# Altium schematic sheet power_supplies.SchDoc: Pounder
size 420 x 297 mm; Author: G.Kasprowicz; CompanyName: WUT ISE; DrawnBy: G.Kasprowicz; Organization: WUT ISE; Address1: PW ISE; Address2: Nowowiejska 15/19 00-665 Warsaw; Address3: gkasprow@gmail.com; DocumentNumber: 6; Revision: 2; SheetNumber: 6; SheetTotal: 7; ModifiedBy: -; CheckedDate: -; Title2: power supply; DivGrp: WUT ISE; Designer: G.Kasprowicz; ModifiedDate: -; ProjectName: Sensor Box
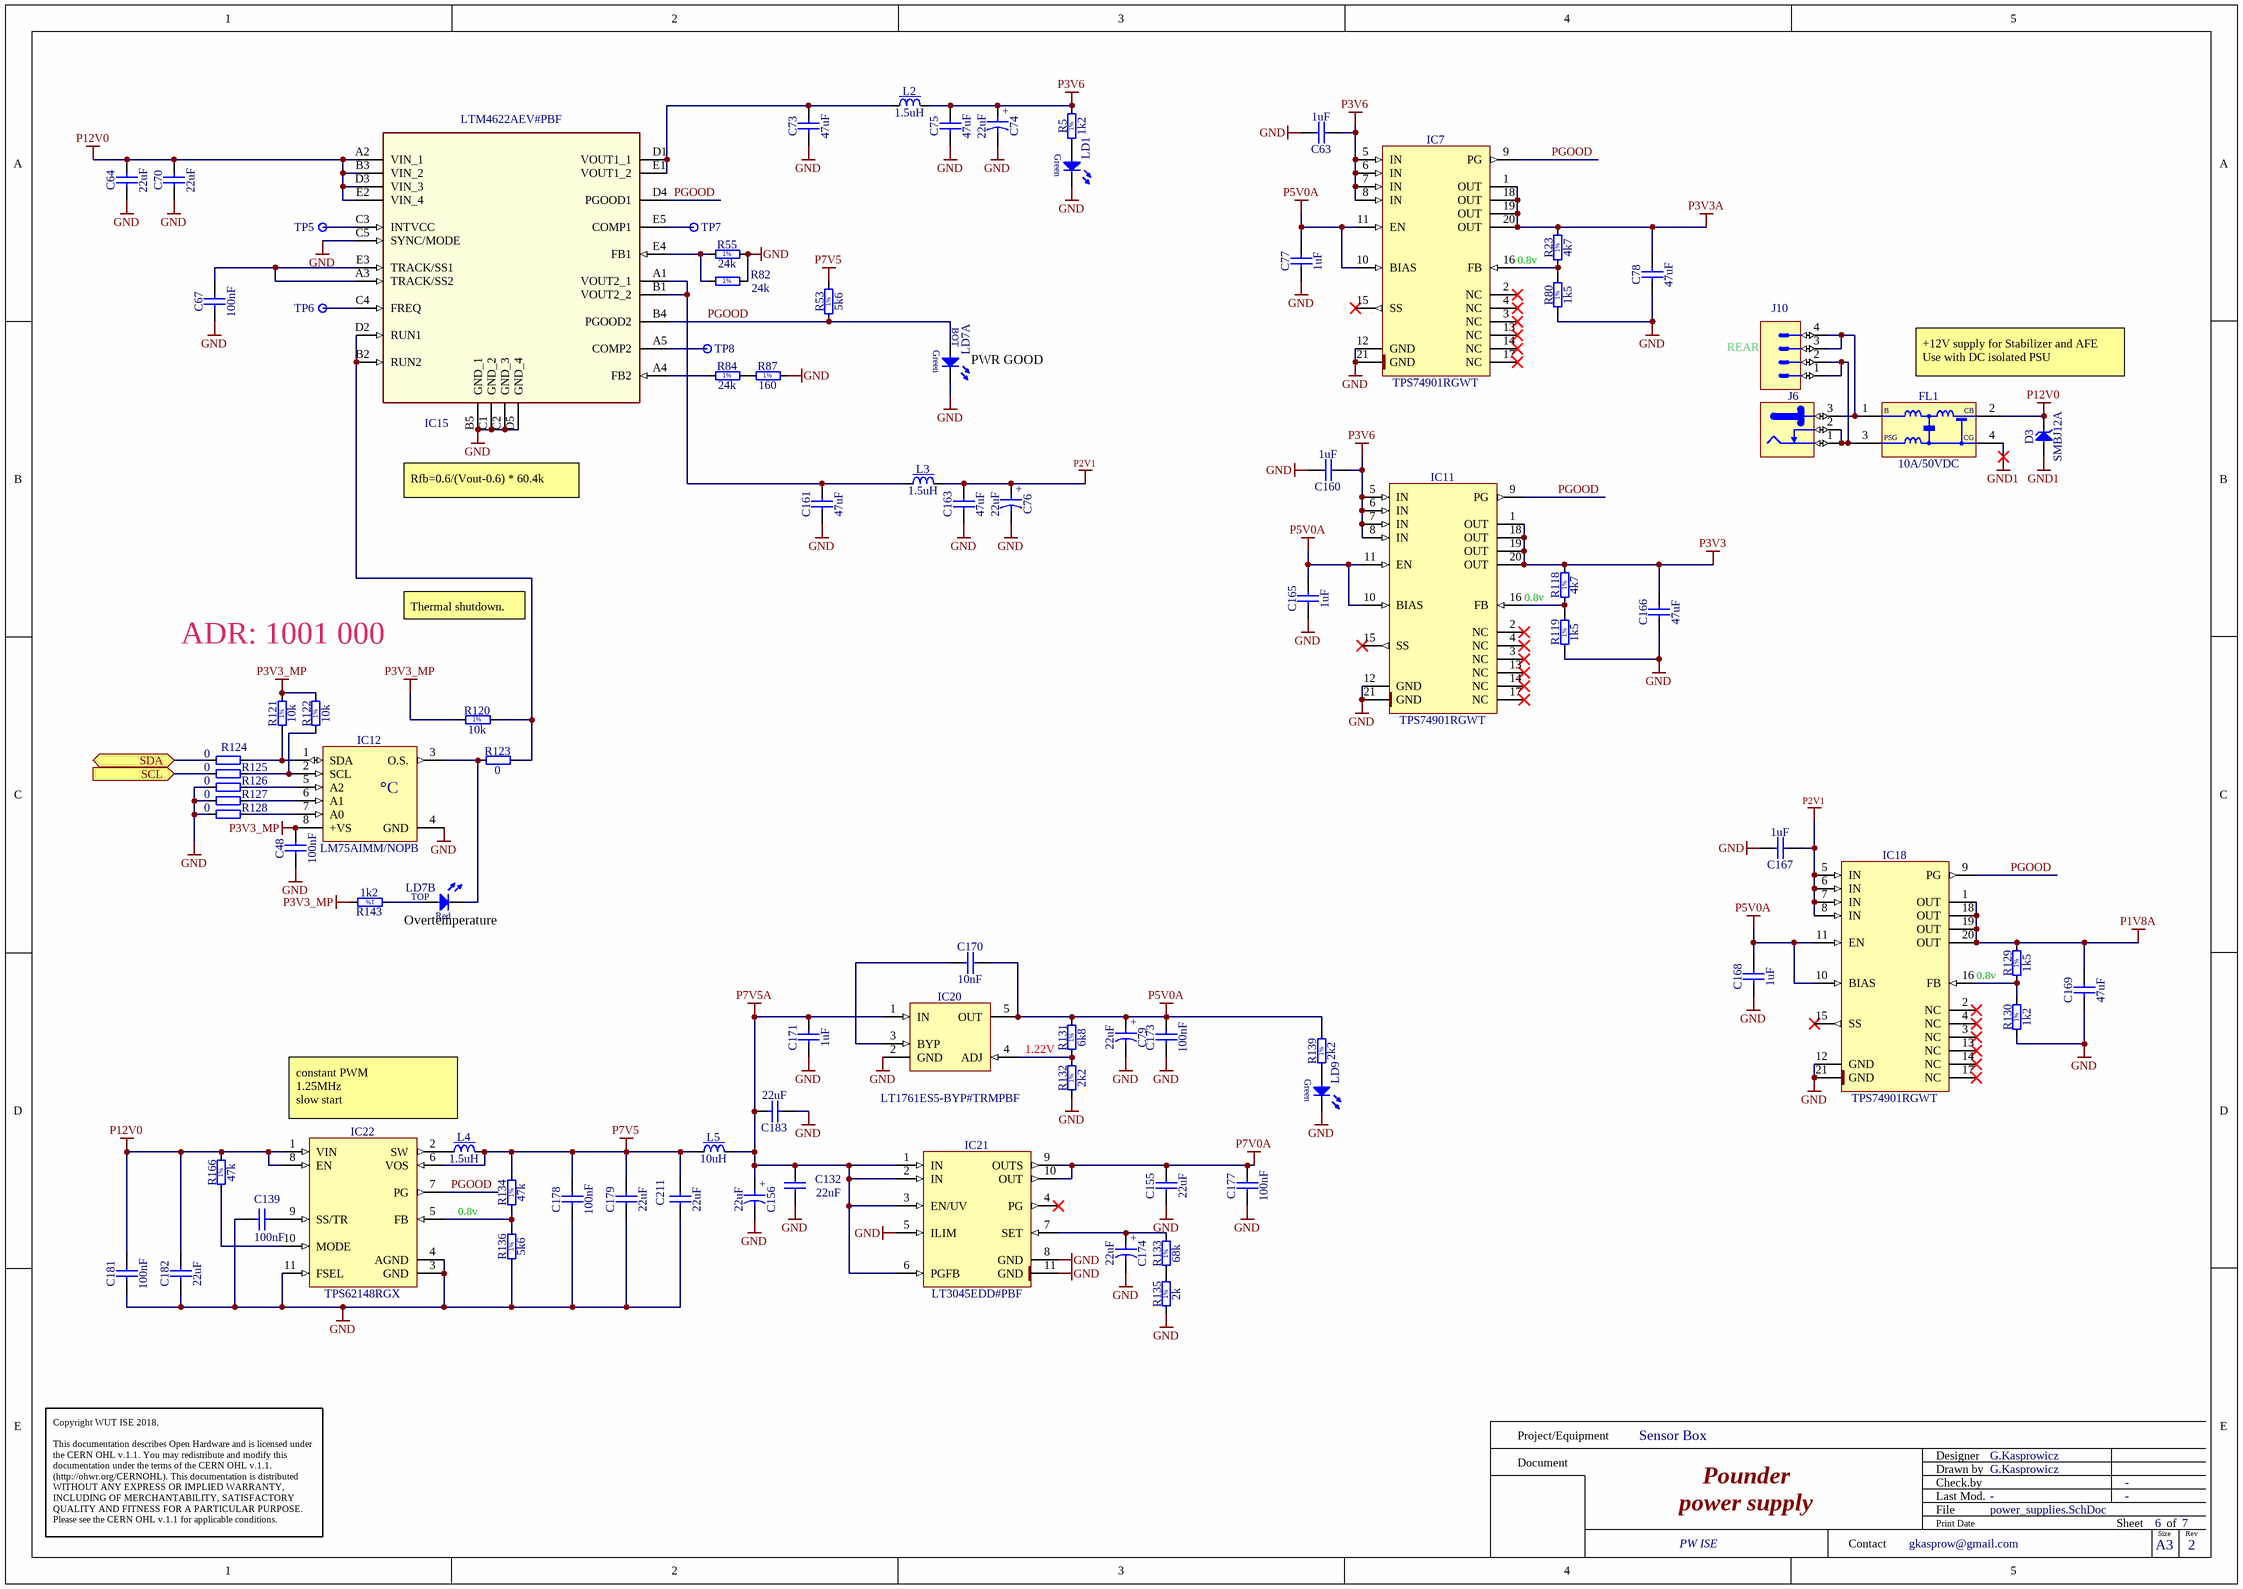
[diagram p0: power_supplies.SchDoc]

## Parts
C48  100nF  [CAPC1005X55N]
C63  1uF  [CAPC1005X55N]
C64  22uF  [CAPC2012X135N]
C67  100nF  [CAPC1005X55N]
C70  22uF  [CAPC2012X135N]
C73  47uF  [CAPC3225X270N]
C74  22uF  [CAPMP3528X210N]
C75  47uF  [CAPC3225X270N]
C76  22uF  [CAPMP3528X210N]
C77  1uF  [CAPC1005X55N]
C78  47uF  [CAPC3225X270N]
C79  22uF  [CAPMP3528X210N]
C132  22uF  [CAPC2012X135N]
C139  100nF  [CAPC1005X55N]
C155  22uF  [CAPC2012X135N]
C156  22uF  [CAPMP3528X210N]
C160  1uF  [CAPC1005X55N]
C161  47uF  [CAPC3225X270N]
C163  47uF  [CAPC3225X270N]
C165  1uF  [CAPC1005X55N]
C166  47uF  [CAPC3225X270N]
C167  1uF  [CAPC1005X55N]
C168  1uF  [CAPC1005X55N]
C169  47uF  [CAPC3225X270N]
C170  10nF  [CAPC1005X55N]
C171  1uF  [CAPC1005X55N]
C173  100nF  [CAPC1005X55N]
C174  22uF  [CAPMP3528X210N]
C177  100nF  [CAPC1005X55N]
C178  100nF  [CAPC1005X55N]
C179  22uF  [CAPC2012X135N]
C181  100nF  [CAPC1005X55N]
C182  22uF  [CAPC2012X135N]
C183  22uF  [CAPC2012X135N]
C211  22uF  [CAPC2012X135N]
D3  SMBJ12A  [DIOM5336X265N]
FL1  10A/50VDC  [FIL_MURATA_BNX02]
IC7  TPS74901RGWT  [QFN65P500X500X100-21N-S325]
IC11  TPS74901RGWT  [QFN65P500X500X100-21N-S325]
IC12  LM75AIMM/NOPB  [SOP65P490X109-8N]
IC15  LTM4622AEV#PBF  [LGA25C127P5X5_625X625X190]
IC18  TPS74901RGWT  [QFN65P500X500X100-21N-S325]
IC20  LT1761ES5-BYP#TRMPBF  [SOT95P280X100-5N]
IC21  LT3045EDD#PBF  [SON50P300X300X80-11N-R175X248]
IC22  TPS62148RGX  [TEXAS_RGX0011A]
J6  Jack  [SWITCHCRAFT_L712RA]  (value not drawn)
J10  Mini-Fit Jr.™  [MOLEX_39-30-0040]  (value not drawn)
L2  1.5uH  [IND_TDK_SPM6530]
L3  1.5uH  [IND_TDK_SPM6530]
L4  1.5uH  [IND_TDK_SPM6530]
L5  10uH  [IND_MURATA-PS_8400]
LD1  Green  [LED_KINGBRIGHT_KPH-1608CGCKr]  (value not drawn)
LD7  Red/Green  [LED_DIALIGHT_571-0112F]  (value not drawn)  (parts A,B of 2)
LD9  Green  [LED_KINGBRIGHT_KPH-1608CGCKr]  (value not drawn)
R5  1k2  [RESC1608X55N]
R23  4k7  [RESC1608X55N]
R53  5k6  [RESC1608X55N]
R55  24k  [RESC1608X55N]
R80  1k5  [RESC1608X55N]
R82  24k  [RESC1608X55N]
R84  24k  [RESC1608X55N]
R87  160  [RESC1608X55N]
R118  4k7  [RESC1608X55N]
R119  1k5  [RESC1608X55N]
R120  10k  [RESC1005X40N]
R121  10k  [RESC1005X40N]
R122  10k  [RESC1005X40N]
R123  0  [RESC1005X40N]
R124  0  [RESC1005X40N]
R125  0  [RESC1005X40N]
R126  0  [RESC1005X40N]
R127  0  [RESC1005X40N]
R128  0  [RESC1005X40N]
R129  1k5  [RESC1608X55N]
R130  1k2  [RESC1608X55N]
R131  6k8  [RESC1608X55N]
R132  2k2  [RESC1608X55N]
R133  68k  [RESC1005X40N]
R134  47k  [RESC1608X55N]
R135  2k  [RESC1005X40N]
R136  5k6  [RESC1608X55N]
R139  2k2  [RESC1608X55N]
R143  1k2  [RESC1608X55N]
R166  47k  [RESC1608X55N]
TP5  Test Point  [TPS127]  (value not drawn)
TP6  Test Point  [TPS127]  (value not drawn)
TP7  Test Point  [TPS127]  (value not drawn)
TP8  Test Point  [TPS127]  (value not drawn)

## Ports
SCL (in), SDA (bidir)

## Nets
GND: C48.1 C63.2 C64.1 C67.1 C70.1 C73.1 C74.2 C75.1 C76.2 C77.1 C78.1 C79.2 C132.1 C139.2 C155.1 C156.2 C160.2 C161.1 C163.1 C165.1 C166.1 C167.2 C168.1 C169.1 C171.1 C173.1 C174.2 C177.1 C178.1 C179.1 C181.1 C182.1 C183.1 C211.1 IC7.12(GND) IC7.21(GND) IC11.12(GND) IC11.21(GND) IC12.4(GND) IC15.B5(GND_1) IC15.C1(GND_2) IC15.C2(GND_3) IC15.C5(SYNC/MODE) IC15.D5(GND_4) IC18.12(GND) IC18.21(GND) IC20.2(GND) IC21.5(ILIM) IC21.8(GND) IC21.11(GND) IC22.3(GND) IC22.4(AGND) IC22.11(FSEL) LD1.1(C) LD7.1(C) LD9.1(C) R55.2 R80.1 R82.2 R87.2 R119.1 R126.1 R127.1 R128.1 R130.1 R132.1 R135.1 R136.1
GND1: D3.2(A) FL1.4(CG)
P1V8A: C169.2 IC18.1(OUT) IC18.18(OUT) IC18.19(OUT) IC18.20(OUT) R129.2
P2V1: C76.1 C163.2 C167.1 IC18.5(IN) IC18.6(IN) IC18.7(IN) IC18.8(IN) L3.2
P3V3: C166.2 IC11.1(OUT) IC11.18(OUT) IC11.19(OUT) IC11.20(OUT) R118.2
P3V3_MP: C48.2 IC12.8(+VS) R120.1 R121.2 R122.2 R143.2
P3V3A: C78.2 IC7.1(OUT) IC7.18(OUT) IC7.19(OUT) IC7.20(OUT) R23.2
P3V6: C63.1 C74.1 C75.2 C160.1 IC7.5(IN) IC7.6(IN) IC7.7(IN) IC7.8(IN) IC11.5(IN) IC11.6(IN) IC11.7(IN) IC11.8(IN) L2.2 R5.2
P5V0A: C77.2 C79.1 C165.2 C168.2 C170.2 C173.2 IC7.10(BIAS) IC7.11(EN) IC11.10(BIAS) IC11.11(EN) IC18.10(BIAS) IC18.11(EN) IC20.5(OUT) R131.2 R139.2
P7V0A: C155.2 C177.2 IC21.9(OUTS) IC21.10(OUT)
P7V5: C178.2 C179.2 C211.2 IC22.6(VOS) L4.2 L5.1 R53.2 R134.2
P7V5A: C132.2 C156.1 C171.2 C183.2 IC20.1(IN) IC21.1(IN) IC21.2(IN) IC21.3(EN/UV) IC21.6(PGFB) L5.2
P12V0: C64.2 C70.2 C181.2 C182.2 D3.1(C) FL1.2(CB) IC15.A2(VIN_1) IC15.B3(VIN_2) IC15.D3(VIN_3) IC15.E2(VIN_4) IC22.1(VIN) IC22.8(EN) R166.2
PGOOD: IC7.9(PG) IC11.9(PG) IC15.B4(PGOOD2) IC15.D4(PGOOD1) IC18.9(PG) IC22.7(PG) LD7.2(A) R53.1
SCL: R125.1 ; port SCL
SDA: R124.1 ; port SDA
NetC67_2: C67.2 IC15.A3(TRACK/SS2) IC15.E3(TRACK/SS1)
NetC73_2: C73.2 IC15.D1(VOUT1_1) IC15.E1(VOUT1_2) L2.1
NetC139_1: C139.1 IC22.9(SS/TR)
NetC161_2: C161.2 IC15.A1(VOUT2_1) IC15.B1(VOUT2_2) L3.1
NetC170_1: C170.1 IC20.3(BYP)
NetC174_1: C174.1 IC21.7(SET) R133.2
NetFL1_1: FL1.1(B) J6.3 J10.3 J10.4
NetFL1_3: FL1.3(PSG) J6.1 J6.2 J10.1 J10.2
NetIC7_16: IC7.16(FB) R23.1 R80.2
NetIC11_16: IC11.16(FB) R118.1 R119.2
NetIC12_1: IC12.1(SDA) R121.1 R124.2
NetIC12_2: IC12.2(SCL) R122.1 R125.2
NetIC12_3: IC12.3(O.S.) LD7.3(C) R123.1
NetIC12_5: IC12.5(A2) R126.2
NetIC12_6: IC12.6(A1) R127.2
NetIC12_7: IC12.7(A0) R128.2
NetIC15_A4: IC15.A4(FB2) R84.1
NetIC15_A5: IC15.A5(COMP2) TP8.1
NetIC15_B2: IC15.B2(RUN2) IC15.D2(RUN1) R120.2 R123.2
NetIC15_C3: IC15.C3(INTVCC) TP5.1
NetIC15_C4: IC15.C4(FREQ) TP6.1
NetIC15_E4: IC15.E4(FB1) R55.1 R82.1
NetIC15_E5: IC15.E5(COMP1) TP7.1
NetIC18_16: IC18.16(FB) R129.1 R130.2
NetIC20_4: IC20.4(ADJ) R131.1 R132.2
NetIC22_2: IC22.2(SW) L4.1
NetIC22_5: IC22.5(FB) R134.1 R136.2
NetIC22_10: IC22.10(MODE) R166.1
NetLD1_2: LD1.2(A) R5.1
NetLD7_4: LD7.4(A) R143.1
NetLD9_2: LD9.2(A) R139.1
NetR84_2: R84.2 R87.1
NetR133_1: R133.1 R135.2

Not connected (* = marked no-connect by the designer): IC7 2(NC)* 3(NC)* 4(NC)* 13(NC)* 14(NC)* 15(SS)* 17(NC)*; IC11 2(NC)* 3(NC)* 4(NC)* 13(NC)* 14(NC)* 15(SS)* 17(NC)*; IC18 2(NC)* 3(NC)* 4(NC)* 13(NC)* 14(NC)* 15(SS)* 17(NC)*; IC21 4(PG)*

## Notes on the sheet
- 0.8v
- (near LD7) PWR GOOD
- (near J10) REAR
- +12V supply for Stabilizer and AFE
  Use with DC isolated PSU
- Rfb=0.6/(Vout-0.6) * 60.4k
- ADR: 1001 000
- Thermal shutdown.
- (near LD7) Overtemperature
- 1.22V
- constant PWM
  1.25MHz
  slow start
- Project/Equipment
- Document
- Designer
- Drawn by
- Check.by
- Copyright WUT ISE 2018.
  This documentation describes Open Hardware and is licensed under the CERN OHL v.1.1. You may redistribute and modify this documentation under the terms of the CERN OHL v.1.1. (http://ohwr.org/CERNOHL). This documentation is distributed WITHOUT ANY EXPRESS OR IMPLIED WARRANTY, INCLUDING OF MERCHANTABILITY, SATISFACTORY QUALITY AND FITNESS FOR A PARTICULAR PURPOSE. Please see the CERN OHL v.1.1 for applicable conditions.
- Contact
- File
- Last Mod.
- Print Date
- Sheet
- Size
- A3
- of
- Rev
- (in symbol CTE3528-21_22UF_10V_10%_LESR0700) +
- (in symbol LED_DIALIGHT_571-0112F, part A) BOT; Green
- (in symbol LED_DIALIGHT_571-0112F, part B) TOP; Red
- (in symbol LM75AIMM/NOPB) °C
- (in symbol R0402_2K_1%_0.0625W_100PPM) 1%
- (in symbol R0402_10K_1%_0.0625W_100PPM) 1%
- (in symbol R0402_68K_1%_0.0625W_100PPM) 1%
- (in symbol R0603_1K2_1%_0.1W_100PPM) 1%
- (in symbol R0603_1K5_1%_0.1W_100PPM) 1%
- (in symbol R0603_2K2_1%_0.1W_100PPM) 1%
- (in symbol R0603_4K7_1%_0.1W_100PPM) 1%
- (in symbol R0603_5k6_1%_0.1W_100PPM) 1%
- (in symbol R0603_5K6_1%_0.1W_100PPM) 1%
- (in symbol R0603_6K8_1%_0.1W_100PPM) 1%
- (in symbol R0603_24K_1%_0.1W_100PPM) 1%
- (in symbol R0603_47K_1%_0.1W_100PPM) 1%
- (in symbol R0603_160R_1%_0.1W_100PPM) 1%

## Library data of the parts
C48 C67 C139 C173 C177 C178 C181 = CC0402_100NF_16V_10%_X5R: Non-polarised capacitor; Part Description: SMD Multilayer Chip Ceramic Capacitor; Manufacturer: GENERIC; Manufacturer1 Part Number: GRM155R61C104KA88D; Voltage: 16V; TC: X5R; Tolerance: ±10%; Part Number: CC0402_100NF_16V_10%_X5R; Component Kind: Standard; Component Type: Standard; Pin Count: 2; Value: 100nF; Status: None; Manufacturer Part Number: CC0402_100NF_16V_10%_X5R; Case: 0402; Mounted: Yes; Socket: No; SMD: Yes; Sense: No; Manufacturer1 Example: MURATA; Manufacturer1 ComponentHeight: 0.55mm; HelpURL: \\cern.ch\dfs\Applications\Altium\Datasheets\CC0402_X5R_MURATA_GRM.pdf; Author: CERN DEM JLC; CreateDate: 10.12.2013; LatestRevisionDate: 10.12.2013
C63 C77 C160 C165 C167 C168 C171 = CC0402_1UF_16V_10%_X5R: Non-polarised capacitor; Part Description: SMD Multilayer Chip Ceramic Capacitor; Manufacturer: GENERIC; Manufacturer1 Part Number: C1005X5R1C105KT; Voltage: 16V; TC: X5R; Tolerance: ±10%; Part Number: CC0402_1UF_16V_10%_X5R; Component Kind: Standard; Component Type: Standard; Pin Count: 2; Value: 1uF; Status: Preferred; Manufacturer Part Number: CC0402_1UF_16V_10%_X5R; Case: 0402; Mounted: Yes; Socket: No; SMD: Yes; Sense: No; Manufacturer1 Example: TDK; Manufacturer1 ComponentHeight: 0.55mm; HelpURL: \\cern.ch\dfs\Applications\Altium\Datasheets\CC0402_X5R_TDK_C.pdf; Author: CERN DEM JLC
  C63 C77 C160 C165 C167 C168: CreateDate: 2012-10-25; LatestRevisionDate: 2012-10-25
  C171: CreateDate: 25.10.2012; LatestRevisionDate: 25.10.2012
C64 C70 C132 C155 C179 C182 C183 C211 = CC0805_22UF_16V_10%_X5R: Non-polarised capacitor; Part Description: SMD Multilayer Chip Ceramic Capacitor; Manufacturer: GENERIC; Manufacturer1 Part Number: C2012X5R1C226KT; Voltage: 16V; TC: X5R; Tolerance: ±10%; Part Number: CC0805_22UF_16V_10%_X5R; Component Kind: Standard; Component Type: Standard; Pin Count: 2; Value: 22uF; Status: Preferred; Manufacturer Part Number: CC0805_22UF_16V_10%_X5R; Case: 0805; Mounted: Yes; Socket: No; SMD: Yes; Sense: No; Manufacturer1 Example: TDK; Manufacturer1 ComponentHeight: 1.35mm; HelpURL: \\cern.ch\dfs\Applications\Altium\Datasheets\CC0805_X5R_TDK_C.pdf; Author: CERN DEM JLC; CreateDate: 25.10.2012; LatestRevisionDate: 25.10.2012
C73 C75 C78 C161 C163 C166 C169 = CC1210_47UF_10V_20%_X5R: Non-polarised capacitor; Part Description: SMD Multilayer Chip Ceramic Capacitor; Manufacturer: GENERIC; Manufacturer1 Part Number: LMK325BJ476MM-T; Voltage: 10V; TC: X5R; Tolerance: ±20%; Part Number: CC1210_47UF_10V_20%_X5R; Component Kind: Standard; Component Type: Standard; Pin Count: 2; Value: 47uF; Status: None; Manufacturer Part Number: CC1210_47UF_10V_20%_X5R; Case: 1210; Mounted: Yes; Socket: No; SMD: Yes; Sense: No; Manufacturer1 Example: TAIYO YUDEN; Manufacturer1 ComponentHeight: 2.7mm; HelpURL: \\cern.ch\dfs\Applications\Altium\Datasheets\CC1210_X5R_TAIYO-YUDEN_HIGH-VALUE.pdf; Author: CERN DEM JLC; CreateDate: 04.05.2011; LatestRevisionDate: 04.05.2011
C74 C76 C79 C156 C174 = CTE3528-21_22UF_10V_10%_LESR0700: Polarised capacitor; Part Description: Low ESR 0R7 Solid Tantalum Chip Capacitor; Manufacturer: GENERIC; Manufacturer1 Part Number: TPSB226K010R0700; Voltage: 10V; Tolerance: ±10%; Part Number: CTE3528-21_22UF_10V_10%_LESR0700; Component Kind: Standard; Component Type: Standard; Pin Count: 2; Value: 22uF; Status: Preferred; Manufacturer Part Number: CTE3528-21_22UF_10V_10%_LESR0700; Case: B; Mounted: Yes; Socket: No; SMD: Yes; Sense: No; Manufacturer1 Example: AVX; Manufacturer1 ComponentHeight: 2.1mm; HelpURL: \\cern.ch\dfs\Applications\Altium\Datasheets\CTE-LESR_AVX_TPS.pdf; Author: CERN DEM JLC; CreateDate: 05.05.2008; LatestRevisionDate: 20.01.2009
C170 = CC0402_10NF_16V_10%_X7R: Non-polarised capacitor; Part Description: SMD Multilayer Chip Ceramic Capacitor; Manufacturer: GENERIC; Manufacturer1 Part Number: 223878715636; Voltage: 16V; TC: X7R; Tolerance: ±10%; Part Number: CC0402_10NF_16V_10%_X7R; Component Kind: Standard; Component Type: Standard; Pin Count: 2; Value: 10nF; Status: Not Recommended; Manufacturer Part Number: CC0402_10NF_16V_10%_X7R; Case: 0402; Mounted: Yes; Socket: No; SMD: Yes; Sense: No; Manufacturer1 Example: PHYCOMP; Manufacturer1 ComponentHeight: 0.55mm; HelpURL: \\cern.ch\dfs\Applications\Altium\Datasheets\CC0402_X7R_PHYCOMP.pdf; Author: CERN DEM JLC; CreateDate: 03.12.2007; LatestRevisionDate: 03.12.2007
D3 = SMBJ12A: Zener Diode; Part Description: Uni-Directional Transient Voltage Suppressor Diode; Manufacturer: FAIRCHILD SEMICONDUCTOR; Voltage: 12V; Power: 600W; PressFit: No; Bonding: No; Part Number: SMBJ12A; Component Kind: Standard; Component Type: Standard; Device: SMBJ12A; PackageDescription: DO-214-AA/SMB Diode, Molded Body; 5.34mm L X 3.625mm W X 2.65mm H, IPC Medium Density; Manufacturer Part Number: SMBJ12A; Pin Count: 2; Case: DO-214AA; Mounted: Yes; Socket: No; SMD: Yes; Sense: No; ComponentHeight: 2.65mm; HelpURL: \\cern.ch\dfs\Applications\Altium\Datasheets\SMBJ.pdf; Author: CERN DEM JLC; CreateDate: 10/04/2013; LatestRevisionDate: 10/04/2013
FL1 = FIL_MURATA_BNX022-01L: Block Type EMIFIL (LC Combined); Part Description: Block Type EMIFIL (LC Combined) SMD Type, BNX02* Series; Manufacturer: MURATA; Resistance: 0.5R; Part Number: FIL_MURATA_BNX022-01L; Component Kind: Standard; Component Type: Standard; Pin Count: 2; Value: 10A/50VDC; Status: None; Manufacturer Part Number: BNX022-01L; Mounted: Yes; Socket: No; SMD: Yes; Sense: No; ComponentHeight: 3.3mm; HelpURL: \\cern.ch\dfs\Applications\Altium\Datasheets\FIL_MURATA_BNX022-01L.pdf; Author: CERN DEM JLC; CreateDate: 10/10/2012; LatestRevisionDate: 10/10/2012
IC7 IC11 IC18 = TPS74901RGWT: 3A, 0.8 to 3.6V Adjustable Low-Dropout Linear Regulator with Programmable Soft-Start; Part Description: 0.8V to 3.6V, 3.0A Low Dropout Linear Regulator with Programmable Soft-Start; Manufacturer: TEXAS INSTRUMENTS; PressFit: No; Bonding: No; Part Number: TPS74901RGWT; Component Kind: Standard; Component Type: Standard; Device: TPS74901RGWT; PackageDescription: QFN, 0.65mm pitch,square; 20 pin, 5mm X 5mm X 1mm H body (w/thermal tab 3.25 X 3.25mm),  IPC Medium Density; Manufacturer Part Number: TPS74901RGWT; Pin Count: 21; Case: QFN20; Mounted: Yes; Socket: No; SMD: Yes; Sense: No; ComponentHeight: 1mm; HelpURL: \\cern.ch\dfs\Applications\Altium\Datasheets\TPS74901RGWT.pdf; Author: CERN DEM JLC; CreateDate: 07.03.2013; LatestRevisionDate: 07.03.2013
IC12 = LM75AIMM/NOPB: Digital Temperature Sensor and Thermal Watchdog with Two-Wire Interface; Part Description: -25° to +100°C ±2°C Digital Temperature Sensor and Thermal Watchdog with Two-Wire Interface; Manufacturer: TEXAS INSTRUMENTS; PressFit: No; Bonding: No; Part Number: LM75AIMM/NOPB; Component Kind: Standard; Component Type: Standard; Device: LM75AIMM/NOPB; PackageDescription: SOP, 0.65mm pitch; 8 pin,3.00mm W X 3.00mm L X 1.09mm H bodyI, PC Medium Density; Manufacturer Part Number: LM75AIMM/NOPB; Pin Count: 8; Case: SSOP8; Mounted: Yes; Socket: No; SMD: Yes; Sense: No; ComponentHeight: 1.09mm; HelpURL: \\cern.ch\dfs\Applications\Altium\Datasheets\LM75AIMM-NOPB.pdf; Author: CERN DEM JLC; CreateDate: 15.10.2012; LatestRevisionDate: 15.10.2012
IC15 = PM_LTM4622: Dual Ultrathin 2A or Single 4A, 3.6V to 20V, 1.5V to 12V   Step-Down DC/DC μModule Regulator; Manufacturer: LINEAR TECHNOLOGY; PressFit: No; Bonding: No; Part Number: LTM4622AEV#PBF; Component Kind: Standard; Component Type: Standard; Device: LTM4622AEV#PBF; PackageDescription: LGA, 25-Leads, Body 6.25x6.25mmx1.90mm, Pitch 1.27mm; Part Description: Dual Ultrathin 2A or Single 4A, 3.6V to 20V, 1.5V to 12V   Step-Down DC/DC μModule Regulator; Manufacturer Part Number: LTM4622AEV#PBF; Pin Count: 25; Case: LGA25; Mounted: Yes; Socket: No; SMD: Yes; Sense: No; ComponentHeight: 2.92mm; HelpURL: \\cern.ch\dfs\Applications\Altium\Datasheets\LTM4619EV#PBF.pdf; Author: GK; CreateDate: 06.05.2010; LatestRevisionDate: 07.12.2011
IC20 = LT1761ES5-BYP#TRMPBF: 100mA, Low Noise, LDO Micropower Adjustable Regulator in SOT-23; Part Description: 1.22V to 20V, 100mA, Low Noise, LDO Adjustable Micropower Regulator; Manufacturer: LINEAR TECHNOLOGY; PressFit: No; Bonding: No; Part Number: LT1761ES5-BYP#TRMPBF; Component Kind: Standard; Component Type: Standard; Device: LT1761ES5-BYP#TRMPBF; PackageDescription: SOT23, 0.95mm pitch; 5 pin, 1.6mm W X 2.9mm L, IPC Medium Density; Manufacturer Part Number: LT1761ES5-BYP#TRMPBF; Pin Count: 5; Case: SOT23; Mounted: Yes; Socket: No; SMD: Yes; Sense: No; ComponentHeight: 1mm; HelpURL: \\cern.ch\dfs\Applications\Altium\Datasheets\LT1761ES5-SD#TRMPBF.pdf; Author: CERN DEM MR; CreateDate: 17.02.2016; LatestRevisionDate: 17.02.2016
IC21 = LT3045EDD#PBF: 20V, 500mA, Ultralow Noise, Ultrahigh PSRR Linear Regulator; Manufacturer: LINEAR TECHNOLOGY; PressFit: No; Bonding: No; Part Number: LT3045EDD#PBF; Component Kind: Standard; Component Type: Standard; Device: LT3045EDD#PBF; PackageDescription: SON, 0.50mm Pitch, 10-pin, 3.00mm W  X 3.00mm L X 0.80mm Height, (w/thermal tab 1.75 X 2.48 mm), IPC Medium Density; Part Description: 20V, 500mA, Ultralow Noise, Ultrahigh PSRR Linear Regulator; Manufacturer Part Number: LT3045EDD#PBF; Pin Count: 11; Case: SON10; Mounted: Yes; Socket: No; SMD: Yes; Sense: No; ComponentHeight: 0.8mm; HelpURL: \\cern.ch\dfs\Applications\Altium\Datasheets\LT3045EDD#PBF.pdf; Author: CERN DEM JLC; CreateDate: 07.12.2016; LatestRevisionDate: 07.12.2016
IC22 = TPS62148RGX: 3V-17V 2A Step-Down Converter, High Accuracy, With DCS-Control; Manufacturer: TEXAS INSTRUMENTS; PressFit: No; Bonding: No; Part Number: TPS62148RGX; Component Kind: Standard; Component Type: Standard; Device: TPS62148RGX; PackageDescription: TEXAS Case Style (R-VQFN-HR-N11), 0.50mm Pitch, 11-pin, 2.00mm W X 3.00mm L X 1.00mm H Body; Part Description: 3V-17V 2A Step-Down Converter, High Accuracy, With DCS-Control; Manufacturer Part Number: TPS62148RGX; Pin Count: 11; Case: QFN14; Mounted: Yes; Socket: No; SMD: Yes; Sense: No; ComponentHeight: 1mm; HelpURL: \\cern.ch\dfs\Applications\Altium\Datasheets\TPS62148RGX.pdf; Author: CERN DEM MR; CreateDate: 08.02.2019; LatestRevisionDate: 08.02.2019
J6 = SWITCHCRAFT_L712RA: 24V /3. 5A, 2.1mm Diameter Pin, SMD DC Power Supply Connector With  Break Contact; Part Description: 12V/5A, 2.5mm Diameter Pin, THT DC Power Supply Connector With  Break Contact; Manufacturer Part Number: L712RA; PressFit: No; Part Number: SWITCHCRAFT_L712RA; Component Kind: Standard; Component Type: Standard; Pin Count: 3; Family: Jack; Mounted: Yes; Socket: No; SMD: No; Sense: No; Status: None; Manufacturer: SWITCHCRAFT; ComponentHeight: 11mm; HelpURL: \\cern.ch\dfs\Applications\Altium\Datasheets\LUMBERG_161314.pdf; Author: GK; CreateDate: 15.02.2011; LatestRevisionDate: 20.07.2011
J10 = MOLEX_39-30-0040: Connector 4 Male; Part Description: 4.20mm (.165") Pitch Mini-Fit Jr. Header, Dual Row, Right Angle with Snap-in Plastic Peg PCB Lock, 4 Circuits; Manufacturer: MOLEX; PressFit: No; Part Number: MOLEX_39-30-0040; Component Kind: Standard; Component Type: Standard; Pin Count: 4; Family: Mini-Fit Jr.™; Mounted: Yes; Socket: No; SMD: No; Sense: No; Status: None; Manufacturer Part Number: 39-30-0040; ComponentHeight: 11.4mm; HelpURL: \\cern.ch\dfs\Applications\Altium\Datasheets\MOLEX_39-30-0040.pdf; Author: CERN DEM JLC; CreateDate: 02/10/2018; LatestRevisionDate: 02/10/2018
L2-L4 = IND_1.5UH_20%_TDK_SPM6530: Inductor With Core; Part Description: SMD Inductor for Power Circuits (Wound Metal), SPM Series; Manufacturer: TDK; Manufacturer Part Number: SPM6530T-1R5M100; Power: 11A; Resistance: 0.0097R; Tolerance: ±20%; Part Number: IND_1.5UH_20%_TDK_SPM6530; Component Kind: Standard; Component Type: Standard; Pin Count: 2; Value: 1.5uH; Status: None; Mounted: Yes; Socket: No; SMD: Yes; Sense: No; ComponentHeight: 3mm; HelpURL: \\cern.ch\dfs\Applications\Altium\Datasheets\IND_TDK_SPM6530.pdf; Author: CERN DEM MR; CreateDate: 08.11.2016; LatestRevisionDate: 08.11.2016
L5 = IND_10UH_10%_MURATA-PS_8400: Inductor With Core; Part Description: Miniature Surface Mount Power Inductor (8400 Serie); Manufacturer: MURATA POWER SOLUTIONS; Manufacturer Part Number: 84103C; Power: 950mA; Resistance: 0.24R; Tolerance: ±10%; Part Number: IND_10UH_10%_MURATA-PS_8400; Component Kind: Standard; Component Type: Standard; Pin Count: 2; Value: 10uH; Status: None; Mounted: Yes; Socket: No; SMD: Yes; Sense: No; ComponentHeight: 2.9mm; HelpURL: \\cern.ch\dfs\Applications\Altium\Datasheets\IND_MURATA-PS_8400.pdf; Author: CERN DEM JLC; CreateDate: 02.07.2012; LatestRevisionDate: 02.07.2012
LD1 LD9 = LED_0603_Green: Green 0603; Part Number: LED_KINGBRIGHT_KPH-1608CGCK; Part Description: SMD Green LED, Case 1.6mmX0.8mm(0603), 0.65mm Thickness; Manufacturer: KINGBRIGHT; Manufacturer Part Number: KPH-1608CGCK; PressFit: No; Bonding: No; Component Kind: Standard; Component Type: Standard; Color: Green; Footprint: LED_KINGBRIGHT_KPH-1608CGCK; PackageDescription: SMT Green LED, Case 0603, Body L 1.6 x W 0.8mm H 0.65mm; Pin Count: 2; Mounted: Yes; Socket: No; SMD: Yes; Sense: No; ComponentHeight: 0.65mm; HelpURL: \\cern.ch\dfs\Applications\Altium\Datasheets\LED_KINGBRIGHT_KPH-1608CGCK.pdf; Author: CERN DEM JLC; CreateDate: 03.07.2017; LatestRevisionDate: 03.07.2017
LD7 = LED_DIALIGHT_571-0112F: 2x LED  Botom Green, Top Red; Part Description: Dual 2mm  LEDs, Red Top,Green Bot, CBI® Circuit Board Indicator (Without positioning pins); PressFit: No; Bonding: No; Part Number: LED_DIALIGHT_571-0112F; Component Kind: Standard; Component Type: Standard; Color: Red/Green; PackageDescription: 2x 2mm LED (Top: Red, Bot: Green) PCB Edge Mounting (Without positioning pins) DIALIGHT 571 Serie; Manufacturer: DIALIGHT; Manufacturer Part Number: 571-0112F; Pin Count: 4; Mounted: Yes; Socket: No; SMD: No; Sense: No; ComponentHeight: 8.6mm; HelpURL: \\cern.ch\dfs\Applications\Altium\Datasheets\LED_DIALIGHT_571-0112F.pdf; Author: CERN DEM JLC; CreateDate: 09.11.2009; LatestRevisionDate: 17.03.2010
R5 R130 R143 = R0603_1K2_1%_0.1W_100PPM: Resistor - 1%; Part Description: General Purpose Thick Film Chip Resistor; Manufacturer: GENERIC; Manufacturer1 Part Number: NRC06F1201TRF; Power: 0.1W; TC: ±100ppm/°C; Part Number: R0603_1K2_1%_0.1W_100PPM; Component Kind: Standard; Component Type: Standard; Pin Count: 2; Value: 1k2; Status: Preferred; Tolerance: ±1%; Manufacturer Part Number: R0603_1K2_1%_0.1W_100PPM; Case: 0603; Mounted: Yes; Sense: No; Socket: No; SMD: Yes; Manufacturer1 Example: NIC COMPONENT; Manufacturer1 ComponentHeight: 0.55mm; HelpURL: \\cern.ch\dfs\Applications\Altium\Datasheets\R0603_NIC_NRC.pdf; Author: CERN DEM JLC; CreateDate: 03.12.2007; LatestRevisionDate: 13.03.2008
R23 R118 = R0603_4K7_1%_0.1W_100PPM: Resistor - 1%; Part Description: General Purpose Thick Film Chip Resistor; Manufacturer: GENERIC; Manufacturer1 Part Number: NRC06F4701TRF; Power: 0.1W; TC: ±100ppm/°C; PressFit: No; Part Number: R0603_4K7_1%_0.1W_100PPM; Component Kind: Standard; Component Type: Standard; Pin Count: 2; Value: 4k7; Status: Preferred; Tolerance: ±1%; Manufacturer Part Number: R0603_4K7_1%_0.1W_100PPM; Case: 0603; Mounted: Yes; Sense: No; Socket: No; SMD: Yes; Manufacturer1 Example: NIC COMPONENT; Manufacturer1 ComponentHeight: 0.55mm; HelpURL: \\cern.ch\dfs\Applications\Altium\Datasheets\R0603_NIC_NRC.pdf; Author: CERN DEM JLC; CreateDate: 03.12.2007; LatestRevisionDate: 13.03.2008
R53 = R0603_5k6_1%_0.1W_100PPM: Resistor - 1%; Part Description: General Purpose Thick Film Chip Resistor; Manufacturer: GENERIC; Manufacturer1 Part Number: NRC06F5601TRF; Power: 0.1W; TC: ±100ppm/°C; PressFit: No; Part Number: R0603_5K6_1%_0.1W_100PPM; Component Kind: Standard; Component Type: Standard; Pin Count: 2; Value: 5k6; Status: Preferred; Tolerance: ±1%; Manufacturer Part Number: R0603_5K6_1%_0.1W_100PPM; Case: 0603; Mounted: Yes; Sense: No; Socket: No; SMD: Yes; Manufacturer1 Example: NIC COMPONENT; Manufacturer1 ComponentHeight: 0.55mm; HelpURL: \\cern.ch\dfs\Applications\Altium\Datasheets\R0603_NIC_NRC.pdf; Author: CERN DEM JLC; CreateDate: 03.12.2007; LatestRevisionDate: 13.03.2008
R55 R82 R84 = R0603_24K_1%_0.1W_100PPM: Resistor - 1%; Part Description: General Purpose Thick Film Chip Resistor; Manufacturer: GENERIC; Manufacturer1 Part Number: NRC06F2402TRF; Power: 0.1W; TC: ±100ppm/°C; PressFit: No; Part Number: R0603_24K_1%_0.1W_100PPM; Component Kind: Standard; Component Type: Standard; Pin Count: 2; Value: 24k; Status: Preferred; Tolerance: ±1%; Manufacturer Part Number: R0603_24K_1%_0.1W_100PPM; Case: 0603; Mounted: Yes; Sense: No; Socket: No; SMD: Yes; Manufacturer1 Example: NIC COMPONENT; Manufacturer1 ComponentHeight: 0.55mm; HelpURL: \\cern.ch\dfs\Applications\Altium\Datasheets\R0603_NIC_NRC.pdf; Author: CERN DEM JLC; CreateDate: 03.12.2007; LatestRevisionDate: 13.03.2008
R80 R119 = R0603_1K5_1%_0.1W_100PPM: Resistor - 1%; Part Description: General Purpose Thick Film Chip Resistor; Manufacturer: GENERIC; Manufacturer1 Part Number: NRC06F1501TRF; Power: 0.1W; TC: ±100ppm/°C; PressFit: No; Part Number: R0603_1K5_1%_0.1W_100PPM; Component Kind: Standard; Component Type: Standard; Pin Count: 2; Value: 1k5; Status: Preferred; Tolerance: ±1%; Manufacturer Part Number: R0603_1K5_1%_0.1W_100PPM; Case: 0603; Mounted: Yes; Sense: No; Socket: No; SMD: Yes; Manufacturer1 Example: NIC COMPONENT; Manufacturer1 ComponentHeight: 0.55mm; HelpURL: \\cern.ch\dfs\Applications\Altium\Datasheets\R0603_NIC_NRC.pdf; Author: CERN DEM JLC; CreateDate: 03.12.2007; LatestRevisionDate: 13.03.2008
R87 = R0603_160R_1%_0.1W_100PPM: Resistor - 1%; Part Description: General Purpose Thick Film Chip Resistor; Manufacturer: GENERIC; Manufacturer1 Part Number: NRC06F1600TRF; Power: 0.1W; TC: ±100ppm/°C; PressFit: No; Part Number: R0603_160R_1%_0.1W_100PPM; Component Kind: Standard; Component Type: Standard; Pin Count: 2; Value: 160; Status: Preferred; Tolerance: ±1%; Manufacturer Part Number: R0603_160R_1%_0.1W_100PPM; Case: 0603; Mounted: Yes; Sense: No; Socket: No; SMD: Yes; Manufacturer1 Example: NIC COMPONENT; Manufacturer1 ComponentHeight: 0.55mm; HelpURL: \\cern.ch\dfs\Applications\Altium\Datasheets\R0603_NIC_NRC.pdf; Author: CERN DEM JLC; CreateDate: 03.12.2007; LatestRevisionDate: 13.03.2008
R120-R122 = R0402_10K_1%_0.0625W_100PPM: Resistor - 1%; Part Description: General Purpose Thick Film Chip Resistor; Manufacturer: GENERIC; Manufacturer1 Part Number: 232270671003L; TC: ±100ppm/°C; PressFit: No; Part Number: R0402_10K_1%_0.0625W_100PPM; Component Kind: Standard; Component Type: Standard; Pin Count: 2; Value: 10k; Status: Not Recommended; Power: 0.0625W; Tolerance: ±1%; Manufacturer Part Number: R0402_10K_1%_0.0625W_100PPM; Case: 0402; Mounted: Yes; Sense: No; Socket: No; SMD: Yes; Manufacturer1 Example: YAGEO PHYCOMP; Manufacturer1 ComponentHeight: 0.4mm; HelpURL: \\cern.ch\dfs\Applications\Altium\Datasheets\R0402_Phycomp_RC0402.pdf; Author: CERN DEM JLC; CreateDate: 03.12.2007; LatestRevisionDate: 17.10.2012
R123-R128 = R0402_0R_JUMPER: Resistor; Part Description: 1A (0.05R Max DC Resistance) Zero Ohm Jumper; Manufacturer: GENERIC; Manufacturer1 Part Number: 232270591001L; Part Number: R0402_0R_JUMPER; Component Kind: Standard; Component Type: Standard; Pin Count: 2; Value: 0; Status: Not recommended; Manufacturer Part Number: R0402_0R_JUMPER; Case: 0402; Mounted: Yes; Sense: No; Socket: No; SMD: Yes; Manufacturer1 Example: YAGEO PHYCOMP; Manufacturer1 ComponentHeight: 0.4mm; HelpURL: \\cern.ch\dfs\Applications\Altium\Datasheets\R0402_Phycomp_RC0402.pdf; Author: CERN DEM JLC; CreateDate: 03.12.2007; LatestRevisionDate: 17.10.2012
R129 = R0603_1K5_1%_0.1W_100PPM: Resistor - 1%; Part Description: General Purpose Thick Film Chip Resistor; Manufacturer: GENERIC; Manufacturer1 Part Number: NRC06F1501TRF; Power: 0.1W; TC: ±100ppm/°C; Part Number: R0603_1K5_1%_0.1W_100PPM; Component Kind: Standard; Component Type: Standard; Pin Count: 2; Value: 1k5; Status: Preferred; Tolerance: ±1%; Manufacturer Part Number: R0603_1K5_1%_0.1W_100PPM; Case: 0603; Mounted: Yes; Sense: No; Socket: No; SMD: Yes; Manufacturer1 Example: NIC COMPONENT; Manufacturer1 ComponentHeight: 0.55mm; HelpURL: \\cern.ch\dfs\Applications\Altium\Datasheets\R0603_NIC_NRC.pdf; Author: CERN DEM JLC; CreateDate: 03.12.2007; LatestRevisionDate: 13.03.2008
R131 = R0603_6K8_1%_0.1W_100PPM: Resistor - 1%; Part Description: General Purpose Thick Film Chip Resistor; Manufacturer: GENERIC; Manufacturer1 Part Number: NRC06F6801TRF; Power: 0.1W; TC: ±100ppm/°C; Part Number: R0603_6K8_1%_0.1W_100PPM; Component Kind: Standard; Component Type: Standard; Pin Count: 2; Value: 6k8; Status: Preferred; Tolerance: ±1%; Manufacturer Part Number: R0603_6K8_1%_0.1W_100PPM; Case: 0603; Mounted: Yes; Sense: No; Socket: No; SMD: Yes; Manufacturer1 Example: NIC COMPONENT; Manufacturer1 ComponentHeight: 0.55mm; HelpURL: \\cern.ch\dfs\Applications\Altium\Datasheets\R0603_NIC_NRC.pdf; Author: CERN DEM JLC; CreateDate: 03.12.2007; LatestRevisionDate: 13.03.2008
R132 R139 = R0603_2K2_1%_0.1W_100PPM: Resistor - 1%; Part Description: General Purpose Thick Film Chip Resistor; Manufacturer: GENERIC; Manufacturer1 Part Number: NRC06F2201TRF; Power: 0.1W; TC: ±100ppm/°C; Part Number: R0603_2K2_1%_0.1W_100PPM; Component Kind: Standard; Component Type: Standard; Pin Count: 2; Value: 2k2; Status: Preferred; Tolerance: ±1%; Manufacturer Part Number: R0603_2K2_1%_0.1W_100PPM; Case: 0603; Mounted: Yes; Sense: No; Socket: No; SMD: Yes; Manufacturer1 Example: NIC COMPONENT; Manufacturer1 ComponentHeight: 0.55mm; HelpURL: \\cern.ch\dfs\Applications\Altium\Datasheets\R0603_NIC_NRC.pdf; Author: CERN DEM JLC; CreateDate: 03.12.2007; LatestRevisionDate: 13.03.2008
R133 = R0402_68K_1%_0.0625W_100PPM: Resistor - 1%; Part Description: General Purpose Thick Film Chip Resistor; Manufacturer: GENERIC; Manufacturer1 Part Number: 232270676803L; TC: ±100ppm/°C; PressFit: No; Part Number: R0402_68K_1%_0.0625W_100PPM; Component Kind: Standard; Component Type: Standard; Pin Count: 2; Value: 68k; Status: Not Recommended; Power: 0.0625W; Tolerance: ±1%; Manufacturer Part Number: R0402_68K_1%_0.0625W_100PPM; Case: 0402; Mounted: Yes; Sense: No; Socket: No; SMD: Yes; Manufacturer1 Example: YAGEO PHYCOMP; Manufacturer1 ComponentHeight: 0.4mm; HelpURL: \\cern.ch\dfs\Applications\Altium\Datasheets\R0402_Phycomp_RC0402.pdf; Author: CERN DEM JLC; CreateDate: 03.12.2007; LatestRevisionDate: 17.10.2012
R134 R166 = R0603_47K_1%_0.1W_100PPM: Resistor - 1%; Part Description: General Purpose Thick Film Chip Resistor; Manufacturer: GENERIC; Manufacturer1 Part Number: NRC06F4702TRF; Power: 0.1W; TC: ±100ppm/°C; Part Number: R0603_47K_1%_0.1W_100PPM; Component Kind: Standard; Component Type: Standard; Pin Count: 2; Value: 47k; Status: Preferred; Tolerance: ±1%; Manufacturer Part Number: R0603_47K_1%_0.1W_100PPM; Case: 0603; Mounted: Yes; Sense: No; Socket: No; SMD: Yes; Manufacturer1 Example: NIC COMPONENT; Manufacturer1 ComponentHeight: 0.55mm; HelpURL: \\cern.ch\dfs\Applications\Altium\Datasheets\R0603_NIC_NRC.pdf; Author: CERN DEM JLC; CreateDate: 03.12.2007; LatestRevisionDate: 13.03.2008
R135 = R0402_2K_1%_0.0625W_100PPM: Resistor - 1%; Part Description: General Purpose Thick Film Chip Resistor; Manufacturer: GENERIC; Manufacturer1 Part Number: 232270672002L; TC: ±100ppm/°C; PressFit: No; Part Number: R0402_2K_1%_0.0625W_100PPM; Component Kind: Standard; Component Type: Standard; Pin Count: 2; Value: 2k; Status: Not Recommended; Power: 0.0625W; Tolerance: ±1%; Manufacturer Part Number: R0402_2K_1%_0.0625W_100PPM; Case: 0402; Mounted: Yes; Sense: No; Socket: No; SMD: Yes; Manufacturer1 Example: YAGEO PHYCOMP; Manufacturer1 ComponentHeight: 0.4mm; HelpURL: \\cern.ch\dfs\Applications\Altium\Datasheets\R0402_Phycomp_RC0402.pdf; Author: CERN DEM JLC; CreateDate: 03.12.2007; LatestRevisionDate: 17.10.2012
R136 = R0603_5K6_1%_0.1W_100PPM: Resistor - 1%; Part Description: General Purpose Thick Film Chip Resistor; Manufacturer: GENERIC; Manufacturer1 Part Number: NRC06F5601TRF; Power: 0.1W; TC: ±100ppm/°C; Part Number: R0603_5K6_1%_0.1W_100PPM; Component Kind: Standard; Component Type: Standard; Pin Count: 2; Value: 5k6; Status: Preferred; Tolerance: ±1%; Manufacturer Part Number: R0603_5K6_1%_0.1W_100PPM; Case: 0603; Mounted: Yes; Sense: No; Socket: No; SMD: Yes; Manufacturer1 Example: NIC COMPONENT; Manufacturer1 ComponentHeight: 0.55mm; HelpURL: \\cern.ch\dfs\Applications\Altium\Datasheets\R0603_NIC_NRC.pdf; Author: CERN DEM JLC; CreateDate: 03.12.2007; LatestRevisionDate: 13.03.2008
TP5-TP8 = SMD_PAD_1.27X1.27MM: Part Description: 1.27mm x 1.27mm PCB Copper Area (SMD Test Point); Mounted: No; Part Number: SMD_PAD_1.27X1.27MM; Component Kind: Standard (No BOM); Component Type: Standard (No BOM); Pin Count: 1; Family: Test Point; Socket: No; SMD: Yes; Sense: No; Status: None; ComponentHeight: 0mm; HelpURL: Undefined; Author: CERN DEM JLC; CreateDate: 12.01.2008; LatestRevisionDate: 12.01.2008; PackageDescription: 1.27mm x 1.27mm PCB Copper Area (SMD Test Point)